# EAGLE schematic Circuit Diagram (EAGLE 9.1.1)
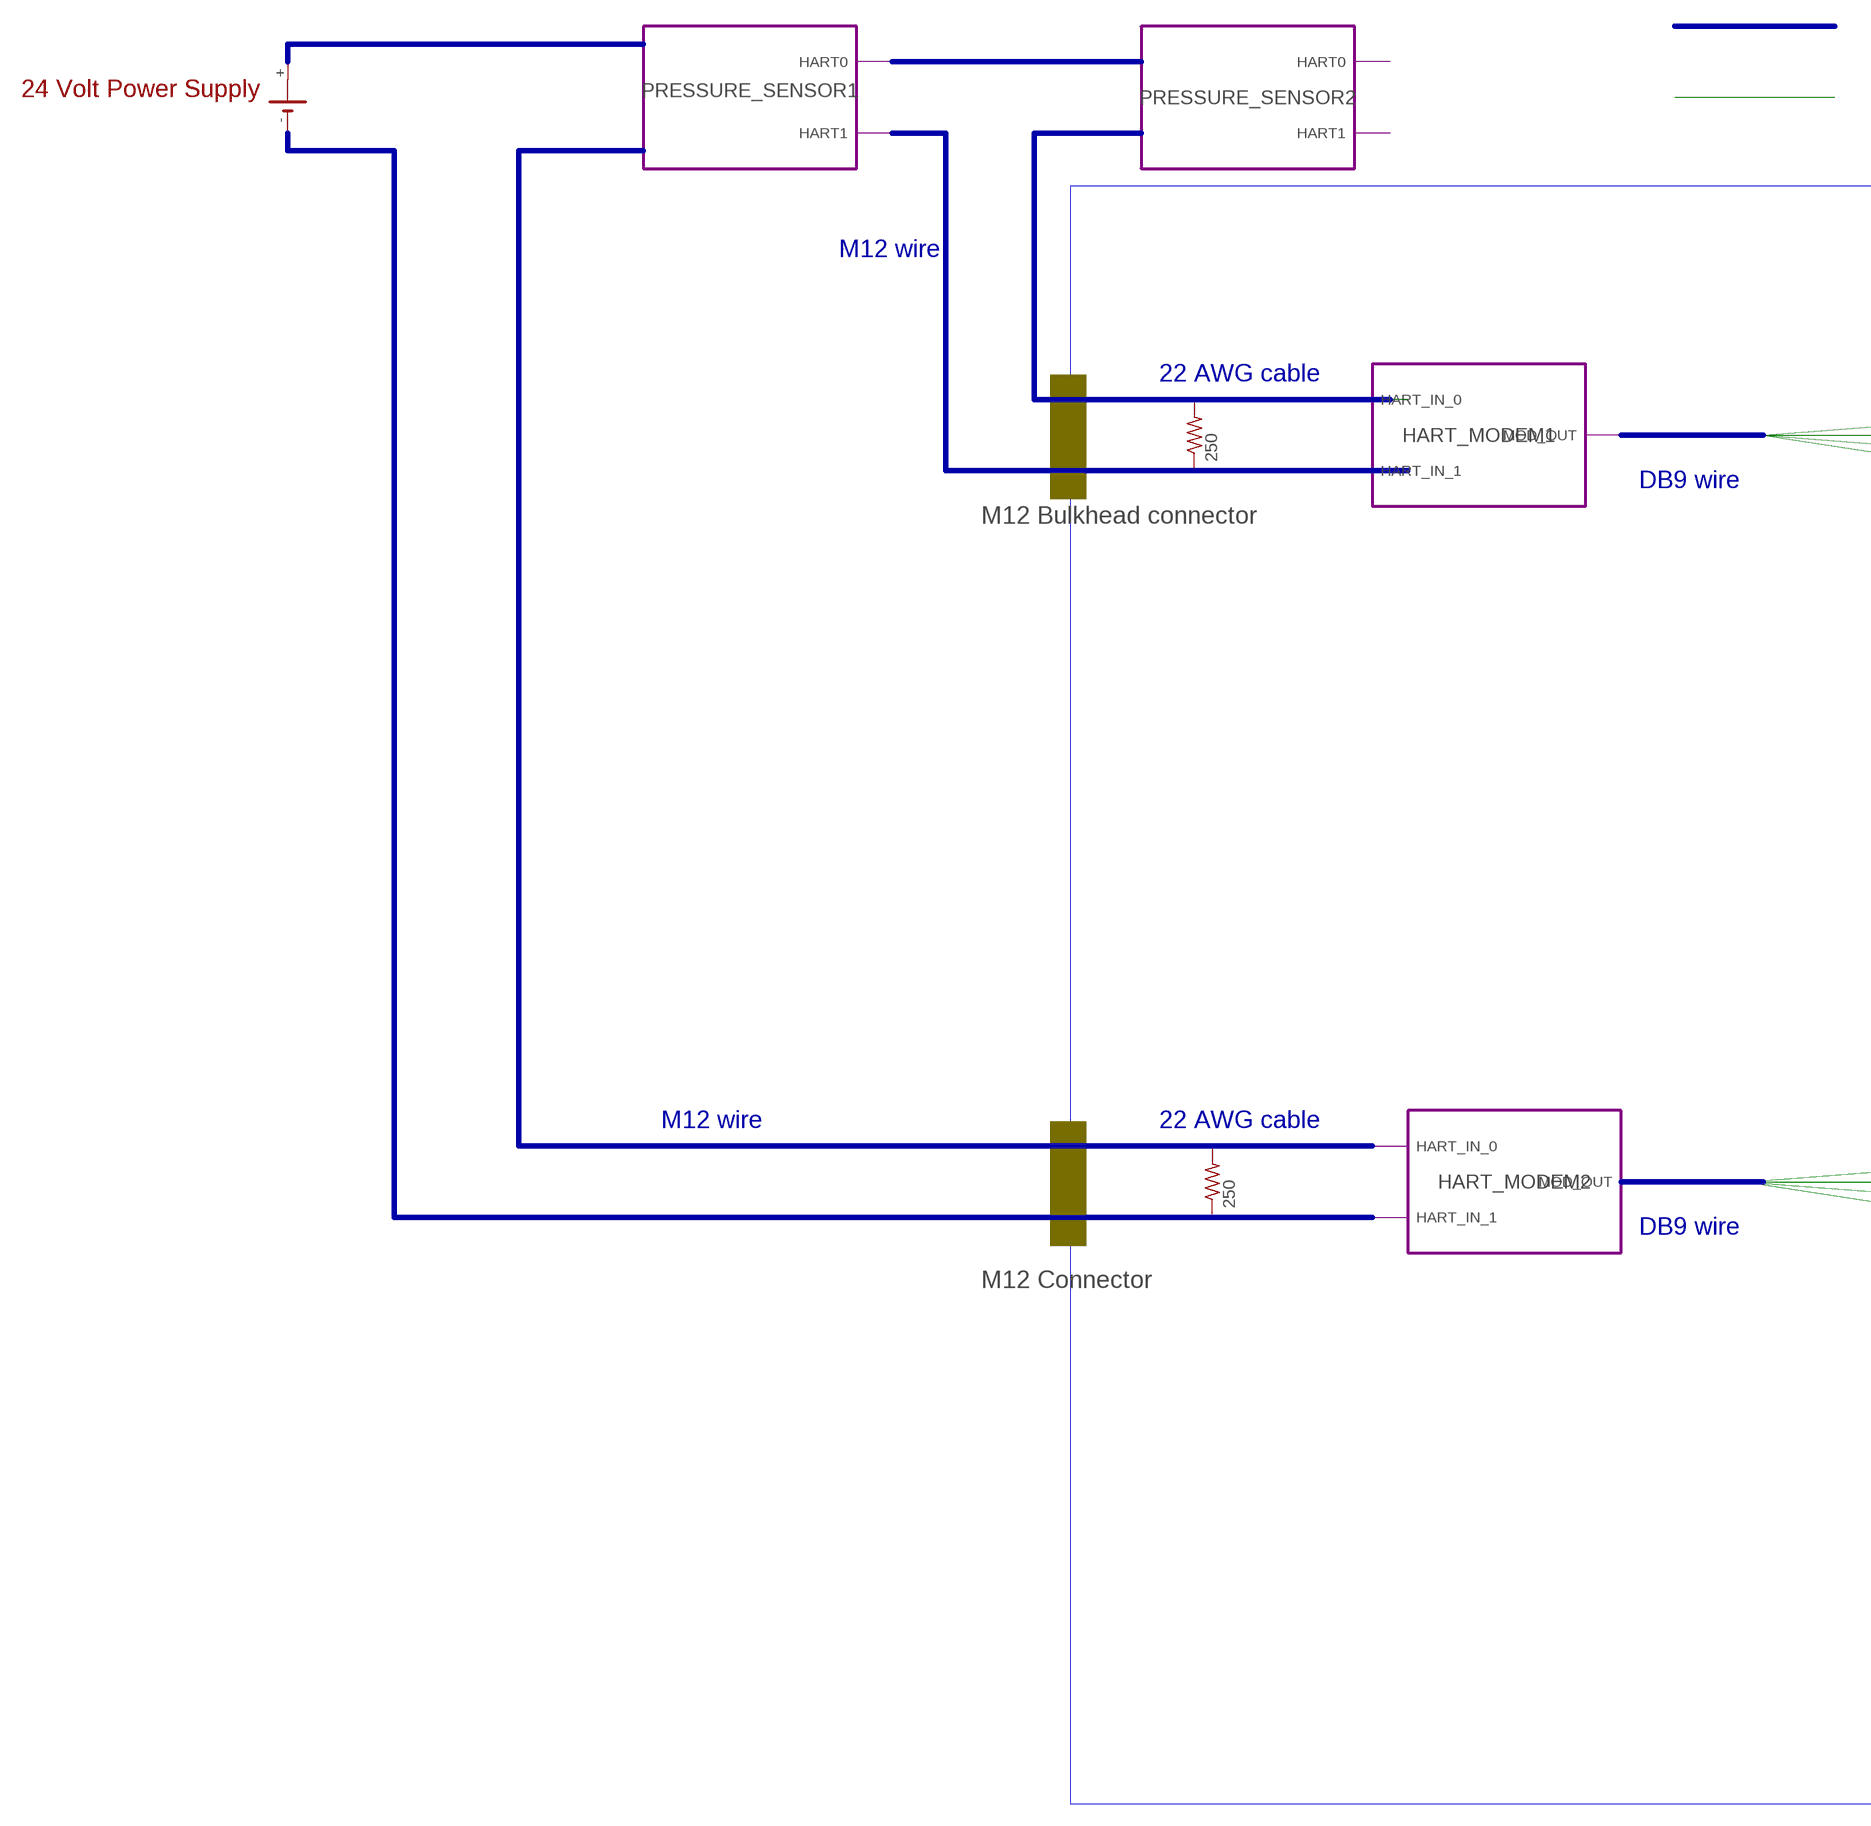
[diagram p0: schematic, sheet 1, part 1 of 2]
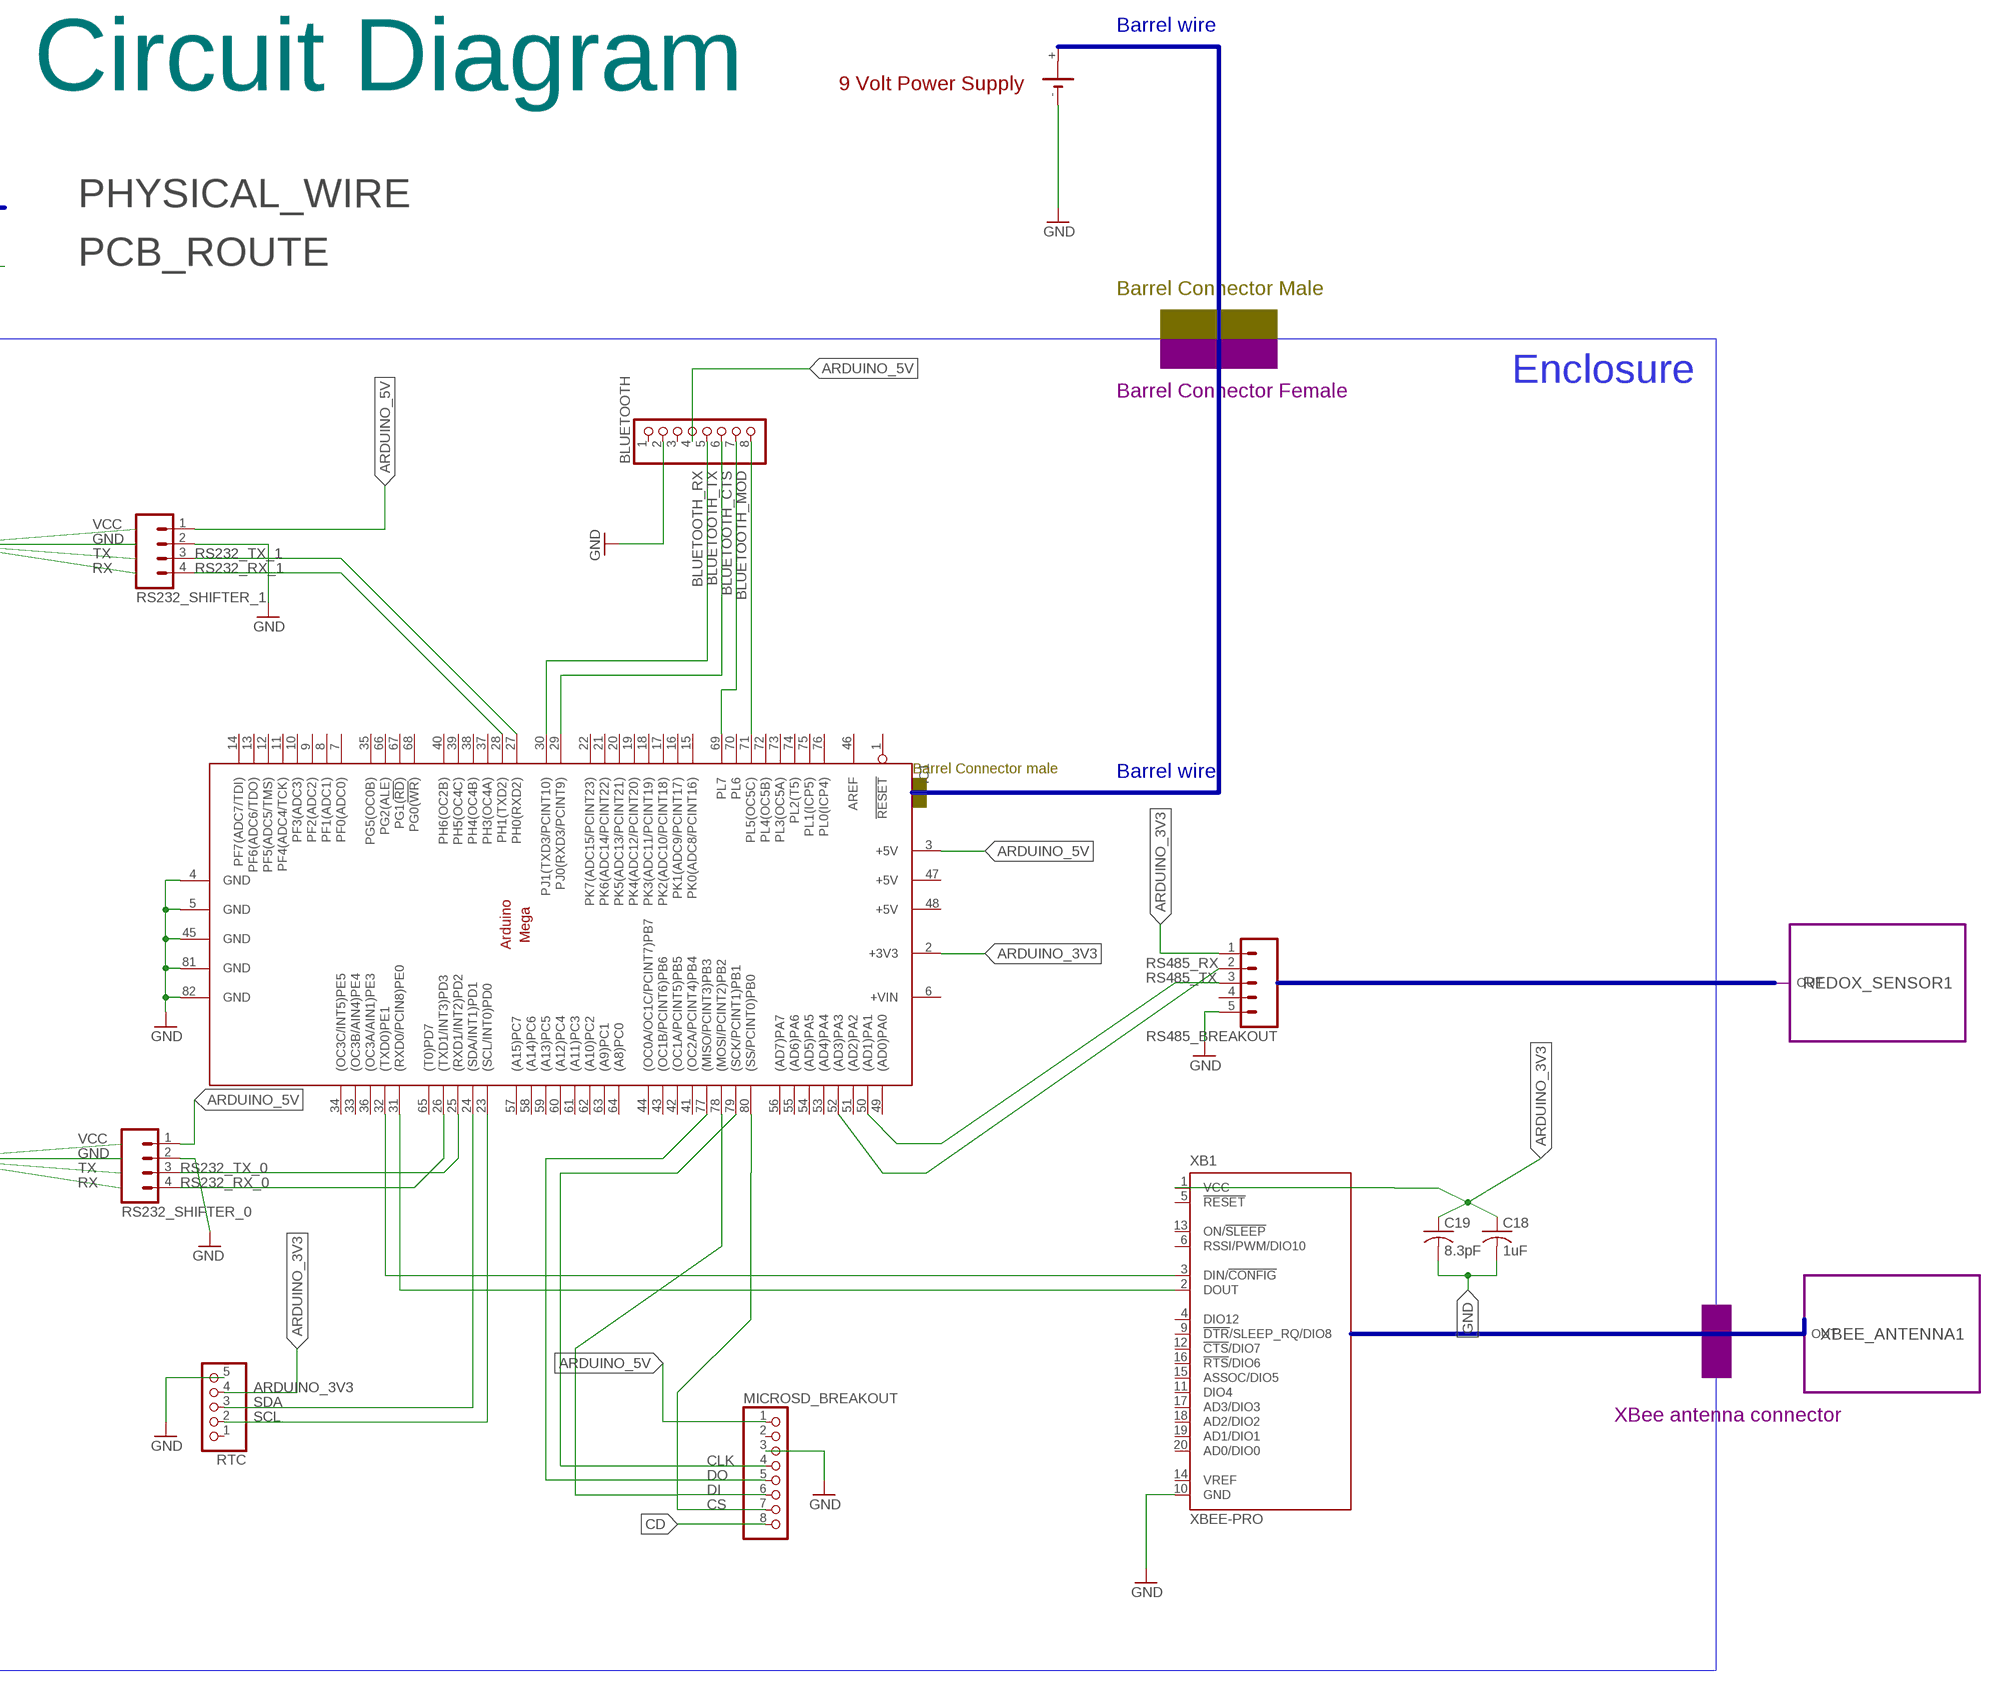
[diagram p1: schematic, sheet 1, part 2 of 2]

## Parts
BLUETOOTH  HEADER-1X876MIL  [1X08_ROUND_76]
C18  1uF  C-USC0805  [C0805]
C19  8.3pF  C-USC0805  [C0805]
G1  24 V  CR-AA  [CRAA]
G2  24 V  CR-AA  [CRAA]
IC1  MEGAARDUINO_1  [MEGA_ARDUINO]
MICROSD_BREAKOUT  PINHD-1X8BIG  [1X08-BIG]
R1  250  R-US_M0805  [M0805]
R3  250  R-US_M0805  [M0805]
RS232_SHIFTER_0  M04PTH  [1X04]
RS232_SHIFTER_1  M04PTH  [1X04]
RS485_BREAKOUT  M05PTH  [1X05]
RTC  HEADER-1X576MIL  [1X05_ROUND_76]
XB1  XBEE-PRO  [XBEE-PRO]

## Module instances
PRESSURE_SENSOR1 = PRESSURE_SENSOR
PRESSURE_SENSOR2 = PRESSURE_SENSOR
HART_MODEM1 = HART_MODEM
HART_MODEM2 = HART_MODEM
REDOX_SENSOR1 = REDOX_SENSOR
XBEE_ANTENNA1 = XBEE_ANTENNA

## Nets
ARDUINO_3V3: C18.1 C19.1 IC1.2(+3V3) RS485_BREAKOUT.1 RTC.4 XB1.1(VCC)
ARDUINO_5V: BLUETOOTH.4 IC1.3(+5V) MICROSD_BREAKOUT.1 RS232_SHIFTER_0.1 RS232_SHIFTER_1.1
BLUETOOTH_CTS: BLUETOOTH.7 IC1.69(PL7)
BLUETOOTH_MOD: BLUETOOTH.8 IC1.71(PL5(OC5C))
BLUETOOTH_RX: BLUETOOTH.5 IC1.30(PJ1(TXD3/PCINT10))
BLUETOOTH_TX: BLUETOOTH.6 IC1.29(PJ0(RXD3/PCINT9))
CD: MICROSD_BREAKOUT.8
CLK: IC1.79((SCK/PCINT1)PB1) MICROSD_BREAKOUT.4
CS: IC1.80((SS/PCINT0)PB0) MICROSD_BREAKOUT.7
DI: IC1.78((MOSI/PCINT2)PB2) MICROSD_BREAKOUT.6
DO: IC1.77((MISO/PCINT3)PB3) MICROSD_BREAKOUT.5
GND: BLUETOOTH.2 C18.2 C19.2 G2.- IC1.4(GND) IC1.5(GND) IC1.45(GND) IC1.81(GND) IC1.82(GND) MICROSD_BREAKOUT.3 RS232_SHIFTER_0.2 RS232_SHIFTER_1.2 RS485_BREAKOUT.5 RTC.5 XB1.10(GND)
N$12: port HART_MODEM1.HART_IN_0
N$15: IC1.25((RXD1/INT2)PD2)
RS232_RX_0: IC1.26((TXD1/INT3)PD3) RS232_SHIFTER_0.4
RS232_RX_1: IC1.28(PH1(TXD2)) RS232_SHIFTER_1.4
RS232_TX_0: RS232_SHIFTER_0.3
RS232_TX_1: IC1.27(PH0(RXD2)) RS232_SHIFTER_1.3
RS485_RX: IC1.52((AD3)PA3) RS485_BREAKOUT.2
RS485_TX: IC1.50((AD1)PA1) RS485_BREAKOUT.3
SCL: IC1.23((SCL/INT0)PD0) RTC.2
SDA: IC1.24((SDA/INT1)PD1) RTC.3
XBEE_RX: IC1.32((TXD0)PE1) XB1.3(DIN/!CONFIG)
XBEE_TX: IC1.31((RXD0/PCIN8)PE0) XB1.2(DOUT)
Unconnected: BLUETOOTH.1 BLUETOOTH.3 G1.+ G1.+@1(+) G1.- G2.+ G2.+@1(+) IC1.1(!RESET) IC1.7(PF0(ADC0)) IC1.8(PF1(ADC1)) IC1.9(PF2(ADC2)) IC1.10(PF3(ADC3)) IC1.11(PF4(ADC4/TCK)) IC1.12(PF5(ADC5/TMS)) IC1.13(PF6(ADC6/TDO)) IC1.14(PF7(ADC7/TDI)) IC1.15(PK0(ADC8/PCINT16)) IC1.16(PK1(ADC9/PCINT17)) IC1.17(PK2(ADC10/PCINT18)) IC1.18(PK3(ADC11/PCINT19)) IC1.19(PK4(ADC12/PCINT20)) IC1.20(PK5(ADC13/PCINT21)) IC1.21(PK6(ADC14/PCINT22)) IC1.22(PK7(ADC15/PCINT23)) IC1.33((OC3B/AIN4)PE4) IC1.34((OC3C/INT5)PE5) IC1.35(PG5(OC0B)) IC1.36((OC3A/AIN1)PE3) IC1.37(PH3(OC4A)) IC1.38(PH4(OC4B)) IC1.39(PH5(OC4C)) IC1.40(PH6(OC2B)) IC1.41((OC2A/PCINT4)PB4) IC1.42((OC1A/PCINT5)PB5) IC1.43((OC1B/PCINT6)PB6) IC1.44((OC0A/OC1C/PCINT7)PB7) IC1.46(AREF) IC1.49((AD0)PA0) IC1.51((AD2)PA2) IC1.53((AD4)PA4) IC1.54((AD5)PA5) IC1.55((AD6)PA6) IC1.56((AD7)PA7) IC1.57((A15)PC7) IC1.58((A14)PC6) IC1.59((A13)PC5) IC1.60((A12)PC4) IC1.61((A11)PC3) IC1.62((A10)PC2) IC1.63((A9)PC1) IC1.64((A8)PC0) IC1.65((T0)PD7) IC1.66(PG2(ALE)) IC1.67(PG1(!RD!)) IC1.68(PG0(!WR!)) IC1.70(PL6) IC1.72(PL4(OC5B)) IC1.73(PL3(OC5A)) IC1.74(PL2(T5)) IC1.75(PL1(ICP5)) IC1.76(PL0(ICP4)) MICROSD_BREAKOUT.2 R1.1 R1.2 R3.1 R3.2 RS485_BREAKOUT.4 RTC.1 XB1.4(DIO12) XB1.5(!RESET) XB1.6(RSSI/PWM/DIO10) XB1.9(!DTR!/SLEEP_RQ/DIO8) XB1.11(DIO4) XB1.12(!CTS!/DIO7) XB1.13(ON/!SLEEP) XB1.14(VREF) XB1.15(ASSOC/DIO5) XB1.16(!RTS!/DIO6) XB1.17(AD3/DIO3) XB1.18(AD2/DIO2) XB1.19(AD1/DIO1) XB1.20(AD0/DIO0)

## Buses
B$5
B$6
B$7
B$8
B$9
B$10
B$3
PHYSICAL_WIRE
B$4
B$11
GND,RX,TX,VCC

## Notes on the sheet
- Barrel wire
- Circuit Diagram | 9 Volt Power Supply
- 24 Volt Power Supply
- Barrel Connector Male
- Enclosure
- M12 wire | Barrel Connector Female
- 22 AWG cable
- DB9 wire
- M12 Bulkhead connector
- Barrel Connector male
- Barrel wire
- M12 wire | 22 AWG cable
- DB9 wire
- M12 Connector
- XBee antenna connector

## Power pins joined to a net without a drawn wire
+5V: IC1.47(+5V) IC1.48(+5V)
+VIN: IC1.6(+VIN)

## Library data of the parts
BLUETOOTH = microbuilder:HEADER-1X8: PIN HEADER
C18 C19 = resistor:C-US: CAPACITOR, American symbol
G1 G2 = battery:CR-AA: LI BATTERY Varta CRAA-SLF
IC1 = arduino:MEGAARDUINO_1: The Arduino Mega is a microcontroller board based on the ATmega1280. - 54 digital input/output pins (of which 14 can be used as PWM outputs) - 16 analog inputs - 4 UARTs (hardware serial ports) - 16 MHz crystal oscillator - USB connection - power jack - ICSP header - reset button It contains everything needed to support the microcontroller; simply connect it to a computer with a USB cable or power it with a AC-to-DC adapter or battery to get started. The Mega is compatible with most shields designed for the Arduino Duemilanove or Diecimila. http://arduino.cc/en/Main/ArduinoBoardMega
MICROSD_BREAKOUT = adafruit:PINHD-1X8: PIN HEADER
R1 R3 = rcl:R-US_: RESISTOR, American symbol; SPICEPREFIX: R
RS232_SHIFTER_0 RS232_SHIFTER_1 = SparkFun-Connectors:M04: Header 4 Standard 4-pin 0.1" header. Use with straight break away headers (SKU : PRT-00116), right angle break away headers (PRT-00553), swiss pins (PRT-00743), machine pins (PRT-00117), and female headers (PRT-00115). Molex polarized connector foot print use with SKU : PRT-08231 with associated crimp pins and housings. 1MM SMD Version SKU: PRT-10208
RS485_BREAKOUT = SparkFun:M05: Header 5 Standard 5-pin 0.1" header. Use with straight break away headers (SKU : PRT-00116), right angle break away headers (PRT-00553), swiss pins (PRT-00743), machine pins (PRT-00117), and female headers (PRT-00115). Molex polarized connector foot print use with SKU : PRT-08230 with associated crimp pins and housings.
RTC = microbuilder:HEADER-1X5: PIN HEADER
XB1 = xbee:XBEE: XBee (TM) /XBee-PRO(TM) OEM RF Modules Source: MaxStream, Inc. xbee_productmanual.pdf; MPN: XBP24-AWI-001; OC_FARNELL: 1337916; OC_NEWARK: 42M2667

## Module PRESSURE_SENSOR
Ports: HART0(io) HART1(io)

### Library data of the parts

## Module HART_MODEM
Ports: HART_IN_0(io) HART_IN_1(io) MOD_OUT(io)

### Library data of the parts

## Module REDOX_SENSOR
Ports: OUT(io)

### Library data of the parts

## Module XBEE_ANTENNA
Ports: OUT(io)

### Library data of the parts